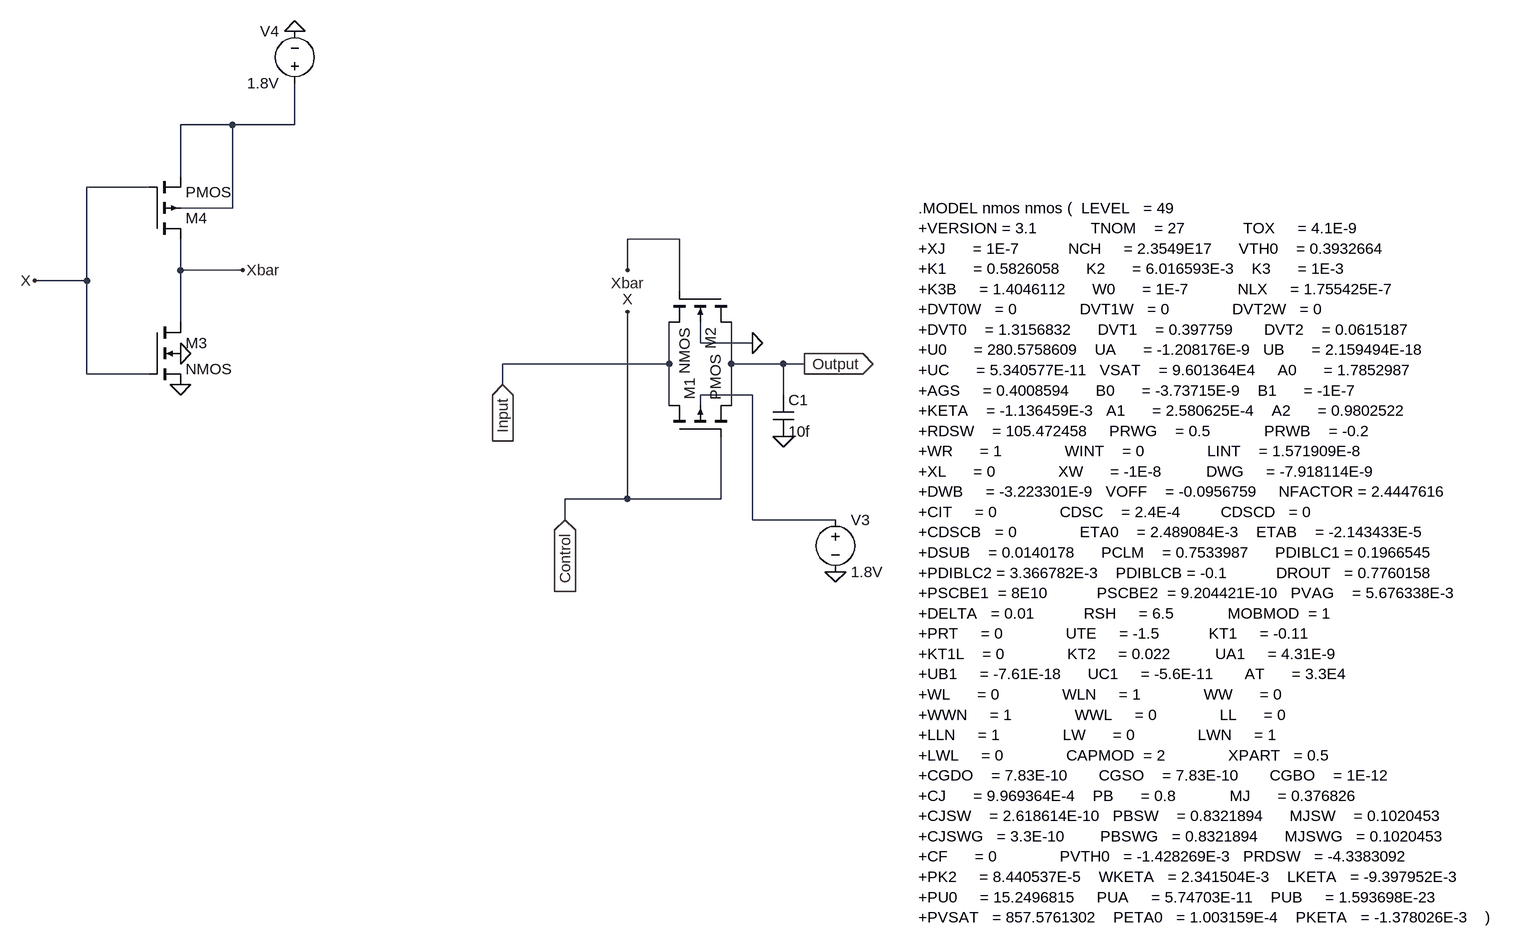
[diagram p0: schematic transmissionGate.asc]
transmissionGate.asc, the LTspice schematic file:
Version 4
SHEET 1 1484 904
WIRE -512 -240 -592 -240
WIRE -416 -240 -416 -304
WIRE -416 -240 -512 -240
WIRE -592 -160 -592 -240
WIRE -640 -144 -736 -144
WIRE -512 -112 -512 -240
WIRE -512 -112 -592 -112
WIRE 176 -64 96 -64
WIRE -592 -16 -592 -64
WIRE -496 -16 -592 -16
WIRE 96 -16 96 -64
WIRE -736 0 -736 -144
WIRE -736 0 -816 0
WIRE 176 16 176 -64
WIRE -592 64 -592 -16
WIRE 208 96 208 64
WIRE 288 96 208 96
WIRE 160 128 160 64
WIRE 160 128 -96 128
WIRE 256 128 256 64
WIRE 336 128 256 128
WIRE 368 128 336 128
WIRE -736 144 -736 0
WIRE -640 144 -736 144
WIRE -96 160 -96 128
WIRE 288 176 208 176
WIRE 336 176 336 128
WIRE 160 192 160 128
WIRE 208 192 208 176
WIRE 256 192 256 128
WIRE 96 336 96 48
WIRE 96 336 0 336
WIRE 240 336 240 240
WIRE 240 336 96 336
WIRE 0 368 0 336
WIRE 288 368 288 176
WIRE 416 368 288 368
FLAG 368 128 Output
IOPIN 368 128 Out
FLAG 336 240 0
FLAG 288 96 0
FLAG 416 448 0
FLAG -592 160 0
FLAG -592 112 0
FLAG -416 -384 0
FLAG -816 0 X
FLAG 96 48 X
FLAG 96 -16 Xbar
FLAG -496 -16 Xbar
FLAG -96 160 Input
IOPIN -96 160 In
FLAG 0 368 Control
IOPIN 0 368 In
SYMBOL pmos4 160 240 R270
SYMATTR InstName M1
SYMATTR Value2 l=180nm w=360nm
SYMBOL nmos4 256 16 R90
SYMATTR InstName M2
SYMATTR Value2 l=180nm w=360nm
SYMBOL cap 320 176 R0
SYMATTR InstName C1
SYMATTR Value 10f
SYMBOL voltage 416 352 R0
WINDOW 123 0 0 Left 0
WINDOW 39 0 0 Left 0
SYMATTR InstName V3
SYMATTR Value 1.8V
SYMBOL nmos4 -640 64 R0
SYMATTR InstName M3
SYMATTR Value2 l=180nm w=360nm
SYMBOL pmos4 -640 -64 M180
SYMATTR InstName M4
SYMATTR Value2 l=180nm w=360nm
SYMBOL voltage -416 -288 R180
WINDOW 0 24 96 Left 2
WINDOW 3 24 16 Left 2
WINDOW 123 0 0 Left 0
WINDOW 39 0 0 Left 0
SYMATTR InstName V4
SYMATTR Value 1.8V
TEXT 544 -112 Left 2 !.MODEL nmos nmos (  LEVEL   = 49\n+VERSION = 3.1            TNOM    = 27             TOX     = 4.1E-9\n+XJ      = 1E-7           NCH     = 2.3549E17      VTH0    = 0.3932664\n+K1      = 0.5826058      K2      = 6.016593E-3    K3      = 1E-3\n+K3B     = 1.4046112      W0      = 1E-7           NLX     = 1.755425E-7\n+DVT0W   = 0              DVT1W   = 0              DVT2W   = 0\n+DVT0    = 1.3156832      DVT1    = 0.397759       DVT2    = 0.0615187\n+U0      = 280.5758609    UA      = -1.208176E-9   UB      = 2.159494E-18\n+UC      = 5.340577E-11   VSAT    = 9.601364E4     A0      = 1.7852987\n+AGS     = 0.4008594      B0      = -3.73715E-9    B1      = -1E-7\n+KETA    = -1.136459E-3   A1      = 2.580625E-4    A2      = 0.9802522\n+RDSW    = 105.472458     PRWG    = 0.5            PRWB    = -0.2\n+WR      = 1              WINT    = 0              LINT    = 1.571909E-8\n+XL      = 0              XW      = -1E-8          DWG     = -7.918114E-9\n+DWB     = -3.223301E-9   VOFF    = -0.0956759     NFACTOR = 2.4447616\n+CIT     = 0              CDSC    = 2.4E-4         CDSCD   = 0\n+CDSCB   = 0              ETA0    = 2.489084E-3    ETAB    = -2.143433E-5\n+DSUB    = 0.0140178      PCLM    = 0.7533987      PDIBLC1 = 0.1966545\n+PDIBLC2 = 3.366782E-3    PDIBLCB = -0.1           DROUT   = 0.7760158\n+PSCBE1  = 8E10           PSCBE2  = 9.204421E-10   PVAG    = 5.676338E-3\n+DELTA   = 0.01           RSH     = 6.5            MOBMOD  = 1\n+PRT     = 0              UTE     = -1.5           KT1     = -0.11\n+KT1L    = 0              KT2     = 0.022          UA1     = 4.31E-9\n+UB1     = -7.61E-18      UC1     = -5.6E-11       AT      = 3.3E4\n+WL      = 0              WLN     = 1              WW      = 0\n+WWN     = 1              WWL     = 0              LL      = 0\n+LLN     = 1              LW      = 0              LWN     = 1\n+LWL     = 0              CAPMOD  = 2              XPART   = 0.5\n+CGDO    = 7.83E-10       CGSO    = 7.83E-10       CGBO    = 1E-12\n+CJ      = 9.969364E-4    PB      = 0.8            MJ      = 0.376826\n+CJSW    = 2.618614E-10   PBSW    = 0.8321894      MJSW    = 0.1020453\n+CJSWG   = 3.3E-10        PBSWG   = 0.8321894      MJSWG   = 0.1020453\n+CF      = 0              PVTH0   = -1.428269E-3   PRDSW   = -4.3383092\n+PK2     = 8.440537E-5    WKETA   = 2.341504E-3    LKETA   = -9.397952E-3\n+PU0     = 15.2496815     PUA     = 5.74703E-11    PUB     = 1.593698E-23\n+PVSAT   = 857.5761302    PETA0   = 1.003159E-4    PKETA   = -1.378026E-3    )

The netlist it stands for:
* transmissionGate.asc
M1 Input Control Output N002 PMOS l=180nm w=360nm
M2 Output Xbar Input 0 NMOS l=180nm w=360nm
C1 Output 0 10f
V3 N002 0 1.8V
M3 Xbar Control 0 0 NMOS l=180nm w=360nm
M4 Xbar Control N001 N001 PMOS l=180nm w=360nm
V4 N001 0 1.8V
.model NMOS NMOS
.model PMOS PMOS
.lib standard.mos
.MODEL nmos nmos (  LEVEL   = 49
+VERSION = 3.1            TNOM    = 27             TOX     = 4.1E-9
+XJ      = 1E-7           NCH     = 2.3549E17      VTH0    = 0.3932664
+K1      = 0.5826058      K2      = 6.016593E-3    K3      = 1E-3
+K3B     = 1.4046112      W0      = 1E-7           NLX     = 1.755425E-7
+DVT0W   = 0              DVT1W   = 0              DVT2W   = 0
+DVT0    = 1.3156832      DVT1    = 0.397759       DVT2    = 0.0615187
+U0      = 280.5758609    UA      = -1.208176E-9   UB      = 2.159494E-18
+UC      = 5.340577E-11   VSAT    = 9.601364E4     A0      = 1.7852987
+AGS     = 0.4008594      B0      = -3.73715E-9    B1      = -1E-7
+KETA    = -1.136459E-3   A1      = 2.580625E-4    A2      = 0.9802522
+RDSW    = 105.472458     PRWG    = 0.5            PRWB    = -0.2
+WR      = 1              WINT    = 0              LINT    = 1.571909E-8
+XL      = 0              XW      = -1E-8          DWG     = -7.918114E-9
+DWB     = -3.223301E-9   VOFF    = -0.0956759     NFACTOR = 2.4447616
+CIT     = 0              CDSC    = 2.4E-4         CDSCD   = 0
+CDSCB   = 0              ETA0    = 2.489084E-3    ETAB    = -2.143433E-5
+DSUB    = 0.0140178      PCLM    = 0.7533987      PDIBLC1 = 0.1966545
+PDIBLC2 = 3.366782E-3    PDIBLCB = -0.1           DROUT   = 0.7760158
+PSCBE1  = 8E10           PSCBE2  = 9.204421E-10   PVAG    = 5.676338E-3
+DELTA   = 0.01           RSH     = 6.5            MOBMOD  = 1
+PRT     = 0              UTE     = -1.5           KT1     = -0.11
+KT1L    = 0              KT2     = 0.022          UA1     = 4.31E-9
+UB1     = -7.61E-18      UC1     = -5.6E-11       AT      = 3.3E4
+WL      = 0              WLN     = 1              WW      = 0
+WWN     = 1              WWL     = 0              LL      = 0
+LLN     = 1              LW      = 0              LWN     = 1
+LWL     = 0              CAPMOD  = 2              XPART   = 0.5
+CGDO    = 7.83E-10       CGSO    = 7.83E-10       CGBO    = 1E-12
+CJ      = 9.969364E-4    PB      = 0.8            MJ      = 0.376826
+CJSW    = 2.618614E-10   PBSW    = 0.8321894      MJSW    = 0.1020453
+CJSWG   = 3.3E-10        PBSWG   = 0.8321894      MJSWG   = 0.1020453
+CF      = 0              PVTH0   = -1.428269E-3   PRDSW   = -4.3383092
+PK2     = 8.440537E-5    WKETA   = 2.341504E-3    LKETA   = -9.397952E-3
+PU0     = 15.2496815     PUA     = 5.74703E-11    PUB     = 1.593698E-23
+PVSAT   = 857.5761302    PETA0   = 1.003159E-4    PKETA   = -1.378026E-3    )
.backanno
.end